# EAGLE design midimonster (EAGLE 4.09)
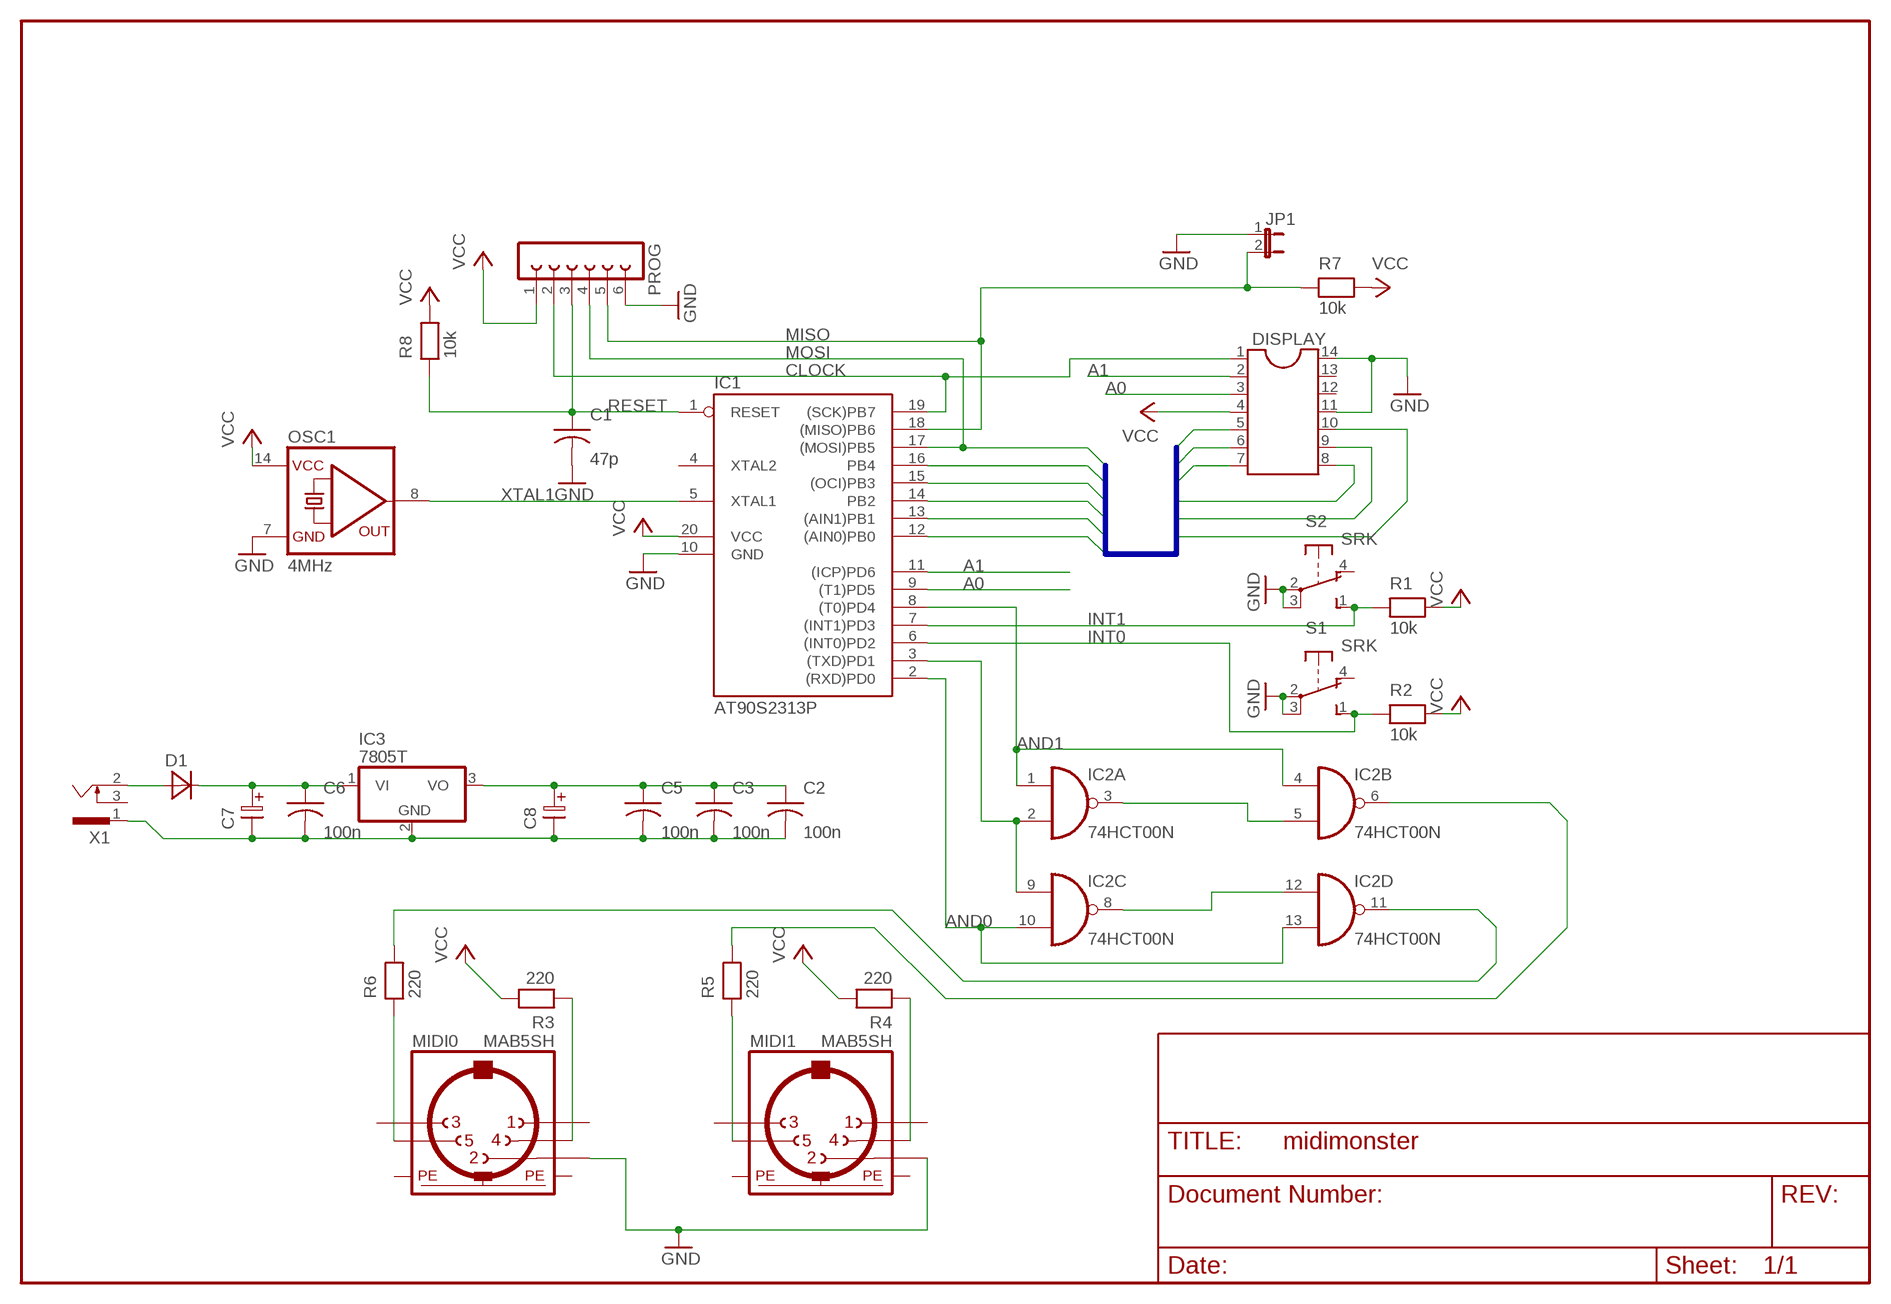
[diagram p0: schematic, sheet 1]

## Parts
C1  47p  CAP-5  [C-5]
C2  100n  CAP-5  [C-5]
C3  100n  CAP-5  [C-5]
C5  100n  CAP-5  [C-5]
C6  100n  CAP-5  [C-5]
C7  ELC-2,5L  [ES-2,5L]
C8  ELC-2,5L  [ES-2,5L]
D1  DIODE-7,5  [D-7,5]
DISPLAY  DIL14  [DIL14]
IC1  AT90S2313P  [DIL20]
IC2  74HCT00N  [DIL14]
IC3  7805T  [TO220H]
JP1  JP1E  [JP1]
MIDI0  MAB5SH  [MAB5SH]
MIDI1  MAB5SH  [MAB5SH]
OSC1  4MHz  QG5860  [DIL14S]
PROG  FE06-1  [FE06]
R1  10k  RESEU-7,5  [R-7,5]
R2  10k  RESEU-7,5  [R-7,5]
R3  220  RESEU-7,5  [R-7,5]
R4  220  RESEU-7,5  [R-7,5]
R5  220  RESEU-7,5  [R-7,5]
R6  220  RESEU-7,5  [R-7,5]
R7  10k  RESEU-7,5  [R-7,5]
R8  10k  RESEU-7,5  [R-7,5]
S1  SRK  [SRK]
S2  SRK  [SRK]
X1  733989-55  [733989-5]

## Nets
A0: DISPLAY.3 IC1.9((T1)PD5)
A1: DISPLAY.2 IC1.11((ICP)PD6)
AND0: IC1.2((RXD)PD0) IC2.10(C:I1) IC2.13(D:I1)
AND1: IC1.8((T0)PD4) IC2.1(A:I0) IC2.4(B:I0)
CLOCK: DISPLAY.1 IC1.19((SCK)PB7) PROG.2
DISP0: DISPLAY.5 IC1.12((AIN0)PB0)
DISP1: DISPLAY.6 IC1.13((AIN1)PB1)
DISP2: DISPLAY.7 IC1.14(PB2)
DISP3: DISPLAY.8 IC1.15((OCI)PB3)
DISP4: DISPLAY.9 IC1.16(PB4)
GND: C1.2 C2.2 C3.2 C5.2 C6.2 C7.2 C8.2 DISPLAY.11 DISPLAY.14 IC1.10(GND) IC3.2(GND) JP1.1 MIDI0.2 MIDI1.2 OSC1.7(GND) PROG.6 S1.2(P) S1.3(P) S2.2(P) S2.3(P) X1.1
INT0: IC1.6((INT0)PD2) R2.1 S1.1(S)
INT1: IC1.7((INT1)PD3) R1.1 S2.1(S)
MISO: IC1.18((MISO)PB6) JP1.2 PROG.5 R7.1
MOSI: DISPLAY.10 IC1.17((MOSI)PB5) PROG.4
N$3: MIDI1.4 R4.1
N$4: IC2.3(A:O) IC2.5(B:I1)
N$5: IC2.8(C:O) IC2.12(D:I0)
N$6: MIDI0.4 R3.1
N$7: MIDI1.5 R5.1
N$8: MIDI0.5 R6.1
N$9: IC2.11(D:O) R6.2
N$10: IC2.6(B:O) R5.2
N$11: D1.1(A) X1.2
N$12: C6.1 C7.1 D1.2(K) IC3.1(VI)
RESET: C1.1 IC1.1(RESET) PROG.3 R8.1
TXD: IC1.3((TXD)PD1) IC2.2(A:I1) IC2.9(C:I0)
VCC: C2.1 C3.1 C5.1 C8.1 DISPLAY.4 IC1.20(VCC) IC3.3(VO) OSC1.14(VCC) PROG.1 R1.2 R2.2 R3.2 R4.2 R7.2 R8.2
XTAL1: IC1.5(XTAL1) OSC1.8(OUT)
Unconnected: DISPLAY.12 DISPLAY.13 IC1.4(XTAL2) MIDI0.1 MIDI0.3 MIDI1.1 MIDI1.3 S1.4(O) S2.4(O) X1.3

## Buses
DISP[0..4],MOSI

## Power pins joined to a net without a drawn wire
GND: IC2.7(P:GND)
PE: MIDI0.PE MIDI0.PE@(PE) MIDI1.PE MIDI1.PE@(PE)
VCC: IC2.14(P:VCC)

## Library data of the parts
C1-C3 C5 C6 = discrete:CAP-5
C7 C8 = discrete:ELC-2,5L
D1 = discrete:DIODE-7,5
DISPLAY = dil:DIL14: SOCKET Dual In Line
IC1 = atmel:AT90S2313: MICROCONTROLLER 2 Kbytes FLASH 128 bytes SRAM 128 bytes EEPROM UART
IC2 = 74xx-eu:74*00: Quad 2-input NAND gate
IC3 = linear:78*: Positive VOLTAGE REGULATOR
JP1 = jumper:JP1E: JUMPER
MIDI0 MIDI1 = con-hirschmann:MAB5SH: Female CONNECTOR 5 pins 90 deg. with shield, horizontal (DIN 41524)
OSC1 = crystal:QG5860: CRYSTAL RESONATOR
PROG = con-lsta:FE06-1: FEMALE HEADER
R1-R8 = discrete:RESEU-7,5
S1 S2 = switch-misc:SRK: SWITCH
X1 = con-conrad:733989-55: FEMALE PRINT CONNECTOR 1.1 mm, FUK HING Industries, distributor Conrad

## Board
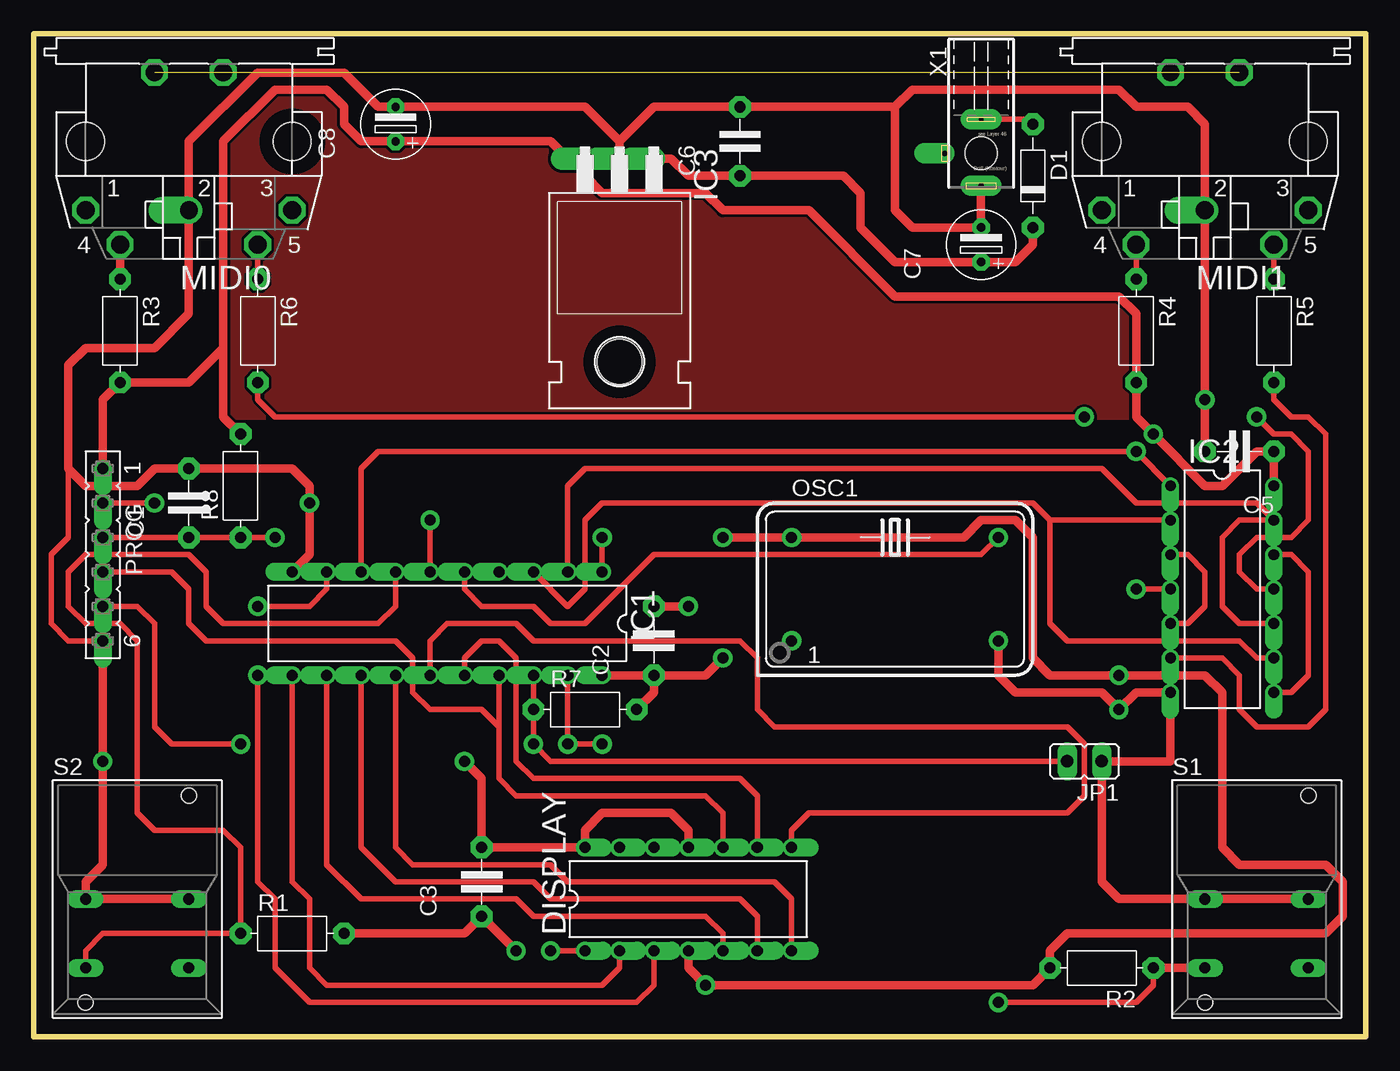
[diagram p1: board, top side]
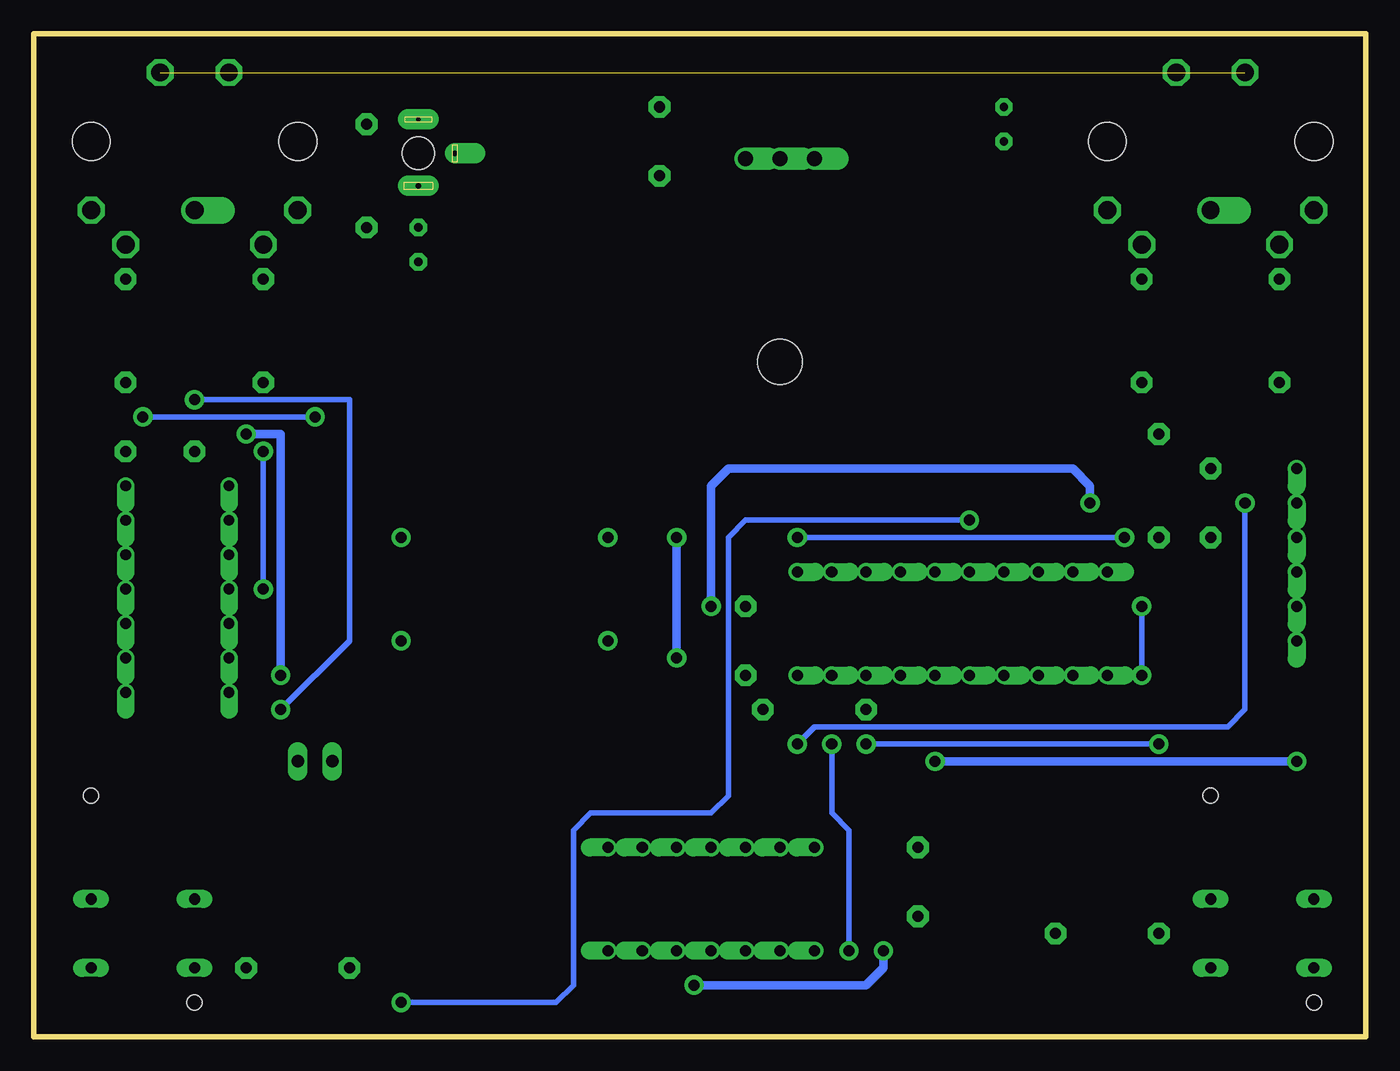
[diagram p2: board, bottom side, seen from below]

Size 98.2 x 73.97 mm. Coordinates in mm from the lower left corner, seen from the top.
Outline: 0,0 98.2,0 98.2,73.97 0,73.97 0,0
Copper layers used: Top, Bottom

### Footprints (pad centres in the part's own frame; a part is rotated, then mirrored left to right if it is on the bottom)
C-5 = drill 0.813 pad 1.6 octagon: 1 -2.54,0; 2 2.54,0
ES-2,5L = drill 0.61 pad 1.27 octagon: 1 0,0; 2 2.54,0
D-7,5 = drill 0.813 pad 1.6 octagon: 1 -3.81,0; 2 3.81,0
DIL14 = drill 0.813 offset: 1 -7.62,-3.81; 2 -5.08,-3.81; 3 -2.54,-3.81; 4 0,-3.81; 5 2.54,-3.81; 6 5.08,-3.81; 7 7.62,-3.81; 8 7.62,3.81; 9 5.08,3.81; 10 2.54,3.81; 11 0,3.81; 12 -2.54,3.81; 13 -5.08,3.81; 14 -7.62,3.81
DIL20 = drill 0.813 offset: 1 -11.43,-3.81; 2 -8.89,-3.81; 3 -6.35,-3.81; 4 -3.81,-3.81; 5 -1.27,-3.81; 6 1.27,-3.81; 7 3.81,-3.81; 8 6.35,-3.81; 9 8.89,-3.81; 10 11.43,-3.81; 11 11.43,3.81; 12 8.89,3.81; 13 6.35,3.81; 14 3.81,3.81; 15 1.27,3.81; 16 -1.27,3.81; 17 -3.81,3.81; 18 -6.35,3.81; 19 -8.89,3.81; 20 -11.43,3.81
DIL14' = drill 0.8 offset: 1 -7.62,-3.81; 2 -5.08,-3.81; 3 -2.54,-3.81; 4 0,-3.81; 5 2.54,-3.81; 6 5.08,-3.81; 7 7.62,-3.81; 8 7.62,3.81; 9 5.08,3.81; 10 2.54,3.81; 11 0,3.81; 12 -2.54,3.81; 13 -5.08,3.81; 14 -7.62,3.81
TO220H = drill 1.118 offset: 1 -2.54,-10.16; 2 0,-10.16; 3 2.54,-10.16 | hole 3.302: 0,4.826
JP1 = drill 0.914 long: 1 0,-1.27; 2 0,1.27
MAB5SH = drill 1.321 octagon: 1 7.62,5.08; 3 -7.62,5.08; 4 5.08,7.62; 5 -5.08,7.62; PE -2.54,-5.08; PE@ 2.54,-5.08 | drill 1.321 offset: 2 0,5.08 | hole 2.794: 7.62,0; -7.62,0
DIL14S = drill 0.813 pad 1.422 round: 1 -7.62,-3.81; 7 7.62,-3.81; 8 7.62,3.81; 14 -7.62,3.81
FE06 = drill 0.813 offset: 1 -6.35,0; 2 -3.81,0; 3 -1.27,0; 4 1.27,0; 5 3.81,0; 6 6.35,0
R-7,5 = drill 0.813 pad 1.6 octagon: 1 -3.81,0; 2 3.81,0
SRK = drill 0.813 long: 1 -3.81,-5.08; 2 -3.81,0; 3 3.81,0; 4 3.81,-5.08 | hole 1.118: -3.81,-7.62; 3.81,7.62
733989-5 = drill 0.4 pad 1.5 long: 1 0,5.82 | drill 0.3 pad 1.5 long: 2 0,0.92 | drill 0.4 pad 1.5 offset: 3 2.7,3.42 | hole 2.4: 0,3.42

### Placement (x,y rotation side)
C1  11.43,39.37 90 top
C2  45.72,29.21 90 top
C3  33.02,11.43 90 top
C5  88.9,43.18 180 top
C6  52.07,66.04 90 top
C7  69.85,57.15 90 top
C8  26.67,66.04 90 top
D1  73.66,63.5 270 top
DISPLAY  48.26,10.16 0 top
IC1  30.48,30.48 180 top
IC2  74HCT00N  [DIL14']  87.63,33.02 270 top
IC3  43.18,54.61 180 top
JP1  77.47,20.32 90 top
MIDI0  11.43,66.04 180 top
MIDI1  86.36,66.04 180 top
OSC1  63.5,33.02 0 top
PROG  5.08,35.56 270 top
R1  19.05,7.62 0 top
R2  78.74,5.08 180 top
R3  6.35,52.07 270 top
R4  81.28,52.07 270 top
R5  91.44,52.07 270 top
R6  16.51,52.07 270 top
R7  40.64,24.13 0 top
R8  15.24,40.64 90 top
S1  90.17,10.16 0 top
S2  7.62,10.16 0 top
X1  69.85,68.58 180 top

### Tracks (layer width: path | path; a pad name or v marks a point on that pad's centre or on a via)
A0  (via drill 0.81 pad 1.42)
  Top 0.406: DISPLAY.3 45.72,3.81 44.45,2.54 20.32,2.54 17.78,5.08 17.78,10.16 16.51,11.43 v16.51,26.67 | IC1.9 21.59,33.02 20.32,31.75 v16.51,31.75
  Bottom 0.406: v16.51,26.67 v16.51,31.75
A1
  Top 0.406: DISPLAY.2 43.18,5.08 41.91,3.81 21.59,3.81 20.32,5.08 20.32,10.16 19.05,11.43 IC1.11
AND0
  Top 0.406: IC1.2 39.37,38.1 39.37,40.64 40.64,41.91 78.74,41.91 81.28,39.37 90.17,39.37 IC2.13 88.9,38.1 87.63,36.83 87.63,31.75 88.9,30.48 IC2.10
AND1  (via drill 0.81 pad 1.42)
  Top 0.406: IC2.1 v81.28,43.18 25.4,43.18 24.13,41.91 IC1.8 | v81.28,33.02 IC2.4
  Bottom 0.406: v81.28,43.18 v81.28,33.02
CLOCK  (via drill 0.81 pad 1.42)
  Top 0.406: v39.37,21.59 IC1.19 v39.37,21.59 | v8.89,39.37 PROG.2 | v38.1,6.35 DISPLAY.1 | v41.91,21.59 v39.37,21.59
  Bottom 0.406: v39.37,21.59 39.37,16.51 38.1,15.24 v38.1,6.35 | v41.91,21.59 40.64,22.86 10.16,22.86 8.89,24.13 v8.89,39.37
DISP0
  Top 0.406: DISPLAY.5 50.8,7.62 49.53,8.89 36.83,8.89 35.56,10.16 24.13,10.16 21.59,12.7 IC1.12
DISP1
  Top 0.406: IC1.13 24.13,13.97 26.67,11.43 36.83,11.43 38.1,10.16 52.07,10.16 53.34,8.89 DISPLAY.6
DISP2
  Top 0.406: DISPLAY.7 55.88,10.16 54.61,11.43 39.37,11.43 38.1,12.7 27.94,12.7 26.67,13.97 IC1.14
DISP3
  Top 0.406: IC1.15 29.21,29.21 30.48,30.48 35.56,30.48 36.83,29.21 52.07,29.21 53.34,27.94 53.34,24.13 54.61,22.86 76.2,22.86 77.47,21.59 77.47,17.78 76.2,16.51 57.15,16.51 55.88,15.24 DISPLAY.8
DISP4
  Top 0.406: IC1.16 31.75,27.94 33.02,29.21 34.29,29.21 35.56,27.94 35.56,20.32 36.83,19.05 52.07,19.05 53.34,17.78 DISPLAY.9
GND  (via drill 0.81 pad 1.42)
  Top 0.406: C7.2 X1.1 | PROG.6 2.54,29.21 1.27,30.48 1.27,35.56 2.54,36.83 2.54,41.91
  Top 0.61: X1.1 C7.2 64.77,59.69 63.5,60.96 63.5,68.58 | 43.18,66.04 40.64,68.58 C8.2 25.4,68.58 22.86,71.12 16.51,71.12 11.43,66.04 MIDI0.2 11.43,53.34 8.89,50.8 3.81,50.8 2.54,49.53 2.54,41.91 3.81,40.64 7.62,40.64 8.89,41.91 C1.2 19.05,41.91 20.32,40.64 v20.32,39.37 20.32,35.56 IC1.10 | 43.18,66.04 IC3.2 | 43.18,66.04 45.72,68.58 | 63.5,68.58 64.77,69.85 80.01,69.85 81.28,68.58 85.09,68.58 86.36,67.31 MIDI1.2 v86.36,46.99 C5.2 | 45.72,68.58 C6.2 | 45.72,68.58 63.5,68.58 | OSC1.7 71.12,26.67 72.39,25.4 78.74,25.4 v80.01,24.13 81.28,25.4 IC2.7 83.82,20.32 JP1.1 78.74,11.43 80.01,10.16 S1.2 S1.3 | C3.2 DISPLAY.14 | DISPLAY.11 48.26,15.24 46.99,16.51 41.91,16.51 40.64,15.24 DISPLAY.14 | v48.26,31.75 C2.2 | S2.3 S2.2 3.81,11.43 5.08,12.7 v5.08,20.32 PROG.6 | C3.2 DISPLAY.14 | C3.2 33.02,19.05 v31.75,20.32
  Bottom 0.406: v86.36,46.99 74.93,46.99 74.93,29.21 v80.01,24.13
  Bottom 0.61: v48.26,31.75 48.26,40.64 46.99,41.91 21.59,41.91 20.32,40.64 v20.32,39.37 | v5.08,20.32 v31.75,20.32
INT0  (via drill 0.81 pad 1.42)
  Top 0.406: R2.1 82.55,3.81 81.28,2.54 v71.12,2.54 | v29.21,38.1 IC1.6
  Top 0.61: R2.1 S1.1
  Bottom 0.406: v29.21,38.1 45.72,38.1 46.99,36.83 46.99,17.78 48.26,16.51 57.15,16.51 58.42,15.24 58.42,3.81 59.69,2.54 v71.12,2.54
INT1
  Top 0.406: IC1.7 26.67,31.75 25.4,30.48 13.97,30.48 12.7,31.75 12.7,34.29 11.43,35.56 3.81,35.56 2.54,34.29 2.54,31.75 3.81,30.48 6.35,30.48 7.62,29.21 7.62,16.51 8.89,15.24 13.97,15.24 15.24,13.97 R1.1 5.08,7.62 3.81,6.35 S2.1
MISO  (via drill 0.81 pad 1.42)
  Top 0.406: IC1.18 R7.1 v36.83,21.59 38.1,20.32 JP1.2 | PROG.5 7.62,31.75 8.89,30.48 8.89,22.86 10.16,21.59 v15.24,21.59
  Bottom 0.406: v15.24,21.59 v36.83,21.59
MOSI
  Top 0.406: 34.29,22.86 34.29,19.05 35.56,17.78 49.53,17.78 50.8,16.51 DISPLAY.10 | 34.29,22.86 IC1.17 | 34.29,22.86 33.02,24.13 29.21,24.13 27.94,25.4 27.94,27.94 26.67,29.21 12.7,29.21 11.43,30.48 11.43,33.02 10.16,34.29 PROG.4
N$1
  pour Top: 13.97,45.72 81.28,45.72 81.28,53.34 80.01,54.61 63.5,54.61 57.15,60.96 50.8,60.96 49.53,62.23 41.91,62.23 38.1,66.04 24.13,66.04 22.86,67.31 22.86,68.58 21.59,69.85 17.78,69.85 13.97,66.04
N$3
  Top 0.406: R4.1 MIDI1.4
N$4
  Top 0.406: IC2.5 85.09,30.48 86.36,31.75 86.36,34.29 85.09,35.56 IC2.3
N$5
  Top 0.406: IC2.12 92.71,35.56 93.98,34.29 93.98,26.67 92.71,25.4 IC2.8
N$6
  Top 0.61: R3.1 MIDI0.4
N$7
  Top 0.406: R5.1 MIDI1.5
N$8
  Top 0.406: R6.1 MIDI0.5
N$9  (via drill 0.81 pad 1.42)
  Top 0.406: IC2.11 90.17,33.02 88.9,34.29 88.9,35.56 90.17,36.83 92.71,36.83 93.98,38.1 93.98,43.18 92.71,44.45 91.44,44.45 v90.17,45.72 | R6.2 16.51,46.99 17.78,45.72 v77.47,45.72
  Bottom 0.406: v77.47,45.72 v90.17,45.72
N$10
  Top 0.406: IC2.6 87.63,27.94 88.9,26.67 88.9,24.13 90.17,22.86 93.98,22.86 95.25,24.13 95.25,44.45 93.98,45.72 92.71,45.72 91.44,46.99 R5.2
N$11
  Top 0.406: X1.2 73.66,67.66 D1.1
N$12
  Top 0.61: C7.1 68.58,57.15 | IC3.1 46.99,64.77 48.26,63.5 C6.1 59.69,63.5 60.96,62.23 60.96,59.69 63.5,57.15 C7.1 | D1.2 73.66,58.42 72.39,57.15 C7.1
PE  (3 unrouted)
RESET  (via drill 0.81 pad 1.42)
  Top 0.406: PROG.3 C1.1 R8.1 v17.78,36.83 | v41.91,36.83 IC1.1
  Bottom 0.406: v17.78,36.83 v41.91,36.83
TXD
  Top 0.406: IC1.3 39.37,31.75 40.64,33.02 40.64,38.1 41.91,39.37 73.66,39.37 74.93,38.1 | 74.93,38.1 IC2.2 | IC2.9 90.17,27.94 88.9,29.21 76.2,29.21 74.93,30.48 74.93,38.1
VCC  (via drill 0.81 pad 1.42)
  Top 0.61: IC2.14 C5.1 90.17,43.18 87.63,40.64 86.36,40.64 v82.55,44.45 81.28,45.72 R4.2 81.28,53.34 80.01,54.61 63.5,54.61 57.15,60.96 50.8,60.96 49.53,62.23 41.91,62.23 40.64,63.5 IC3.3 39.37,64.77 38.1,66.04 C8.1 24.13,66.04 22.86,67.31 22.86,68.58 21.59,69.85 17.78,69.85 13.97,66.04 13.97,50.8 | C2.1 IC1.20 | 13.97,50.8 11.43,48.26 R3.2 5.08,46.99 PROG.1 | R8.2 13.97,45.72 13.97,50.8 | DISPLAY.4 48.26,5.08 v49.53,3.81 73.66,3.81 R2.2 74.93,6.35 76.2,7.62 95.25,7.62 96.52,8.89 96.52,11.43 95.25,12.7 88.9,12.7 87.63,13.97 87.63,25.4 86.36,26.67 v80.01,26.67 74.93,26.67 73.66,27.94 73.66,36.83 72.39,38.1 69.85,38.1 68.58,36.83 OSC1.14 52.07,36.83 v50.8,36.83 | R1.2 31.75,7.62 C3.1 v35.56,6.35 | R7.2 45.72,25.4 C2.1 | C2.1 49.53,26.67 v50.8,27.94
  Bottom 0.61: v35.56,6.35 35.56,5.08 36.83,3.81 v49.53,3.81 | v50.8,36.83 v50.8,27.94 | v80.01,26.67 80.01,44.45 v82.55,44.45
XTAL1
  Top 0.406: OSC1.8 69.85,35.56 45.72,35.56 40.64,30.48 38.1,30.48 36.83,31.75 33.02,31.75 31.75,33.02 IC1.5